# EAGLE design V3 (EAGLE 6.4)
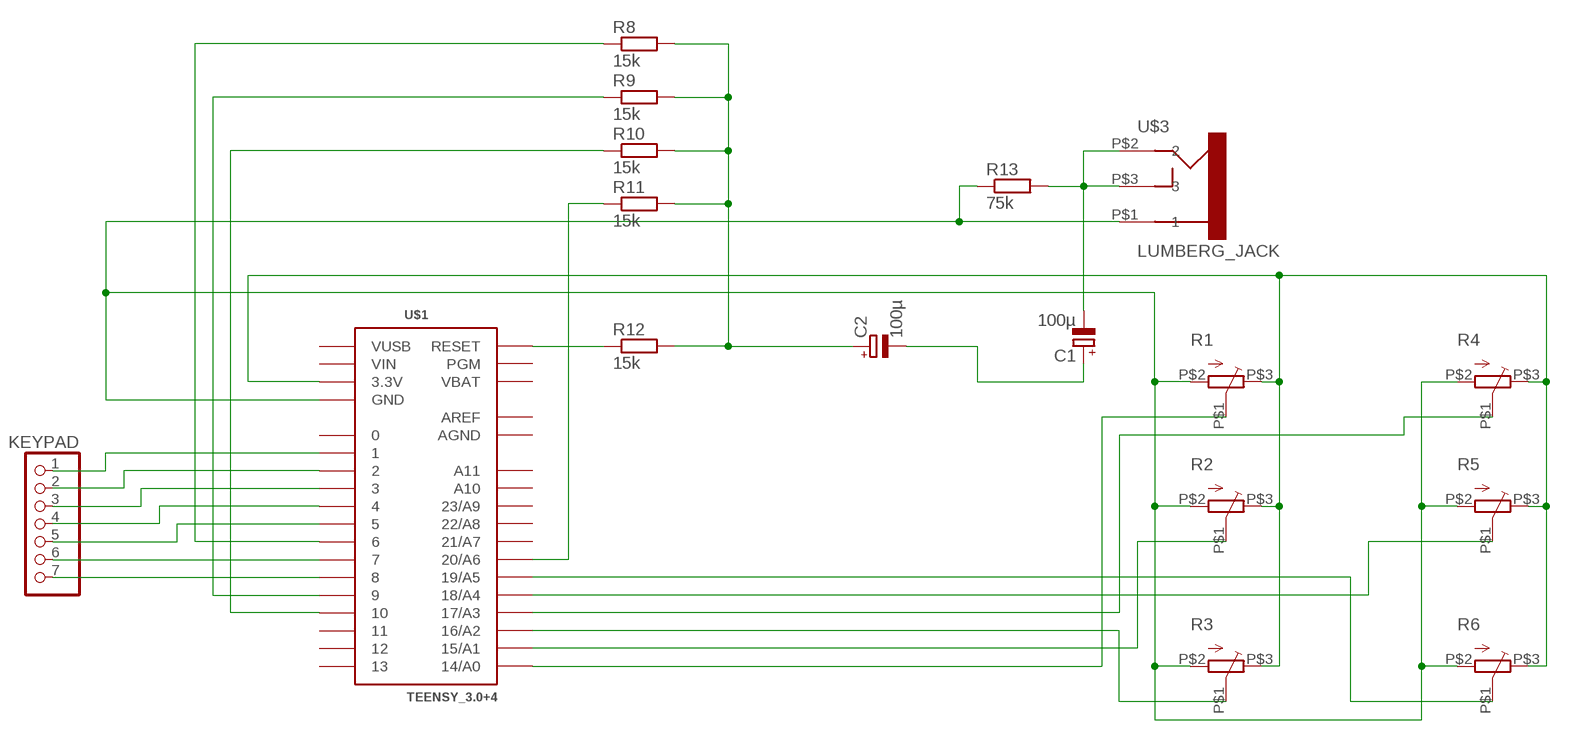
[diagram p0: schematic, sheet 1]

## Parts
C1  100µ  CPOL-EUE2.5-6  [E2,5-6]
C2  100µ  CPOL-EUE2.5-6  [E2,5-6]
KEYPAD  PINHD-1X7  [1X07]
R1  STR09K113  [STR09K113]
R2  STR09K113  [STR09K113]
R3  STR09K113  [STR09K113]
R4  STR09K113  [STR09K113]
R5  STR09K113  [STR09K113]
R6  STR09K113  [STR09K113]
R8  15k  R-EU_0309/12  [0309/12]
R9  15k  R-EU_0309/12  [0309/12]
R10  15k  R-EU_0309/12  [0309/12]
R11  15k  R-EU_0309/12  [0309/12]
R12  15k  R-EU_0309/12  [0309/12]
R13  75k  R-EU_0309/12  [0309/12]
U$1  TEENSY_3.0+4  [TEENSY_3.0+4]
U$3  LUMBERG_JACK  [JACK_CON]

## Nets
GND: R1.P$2(S) R2.P$2(S) R3.P$2(S) R4.P$2(S) R5.P$2(S) R6.P$2(S) R13.1 U$1.GND U$1.GND1(GND) U$3.P$1
N$1: R1.P$1(W) U$1.14/A0
N$2: R2.P$1(W) U$1.15/A1
N$3: R3.P$1(W) U$1.16/A2
N$4: R4.P$1(W) U$1.17/A3
N$5: R5.P$1(W) U$1.18/A4
N$6: R6.P$1(W) U$1.19/A5
N$7: KEYPAD.5 U$1.5
N$8: R1.P$3(E) R2.P$3(E) R3.P$3(E) R4.P$3(E) R5.P$3(E) R6.P$3(E) U$1.3.3V U$1.3.3V1(3.3V)
N$9: C1.- R13.2 U$3.P$2 U$3.P$3
N$10: KEYPAD.4 U$1.4
N$11: KEYPAD.3 U$1.3
N$12: KEYPAD.2 U$1.2
N$13: R8.1 U$1.6
N$14: KEYPAD.6 U$1.7
N$15: KEYPAD.7 U$1.8
N$16: KEYPAD.1 U$1.1
N$22: R9.1 U$1.9
N$23: R10.1 U$1.10
N$26: R12.1 U$1.RESET
N$27: C1.+ C2.-
N$29: R11.1 U$1.20/A6
N$31: C2.+ R8.2 R9.2 R10.2 R11.2 R12.2
Unconnected: U$1.0 U$1.11 U$1.12 U$1.13 U$1.21/A7 U$1.22/A8 U$1.23/A9 U$1.A10 U$1.A11 U$1.PGM

## Power pins joined to a net without a drawn wire
AGND: U$1.AGND
AREF: U$1.AREF
VBAT: U$1.VBAT
VIN: U$1.VIN
VUSB: U$1.VUSB

## Library data of the parts
C1 C2 = rcl:CPOL-EU: POLARIZED CAPACITOR, European symbol
KEYPAD = pinhead:PINHD-1X7: PIN HEADER
R1-R6 = anyma-lib:STR09K113: Alps Potentiometer
R8-R13 = resistor:R-EU_: RESISTOR, European symbol
U$1 = Teensy3.0:TEENSY_3.0+4: Teensy 3.0 board, showing all pins that are easily acessible. See 'AllAnalogPins" and 'AllPins' packages for additional pin holes, as needed. The 'Basic' package has fewer pins.
U$3 = eigene:LUMBERG_JACK: 3.5 mm Jack connector 1502 03

## Board
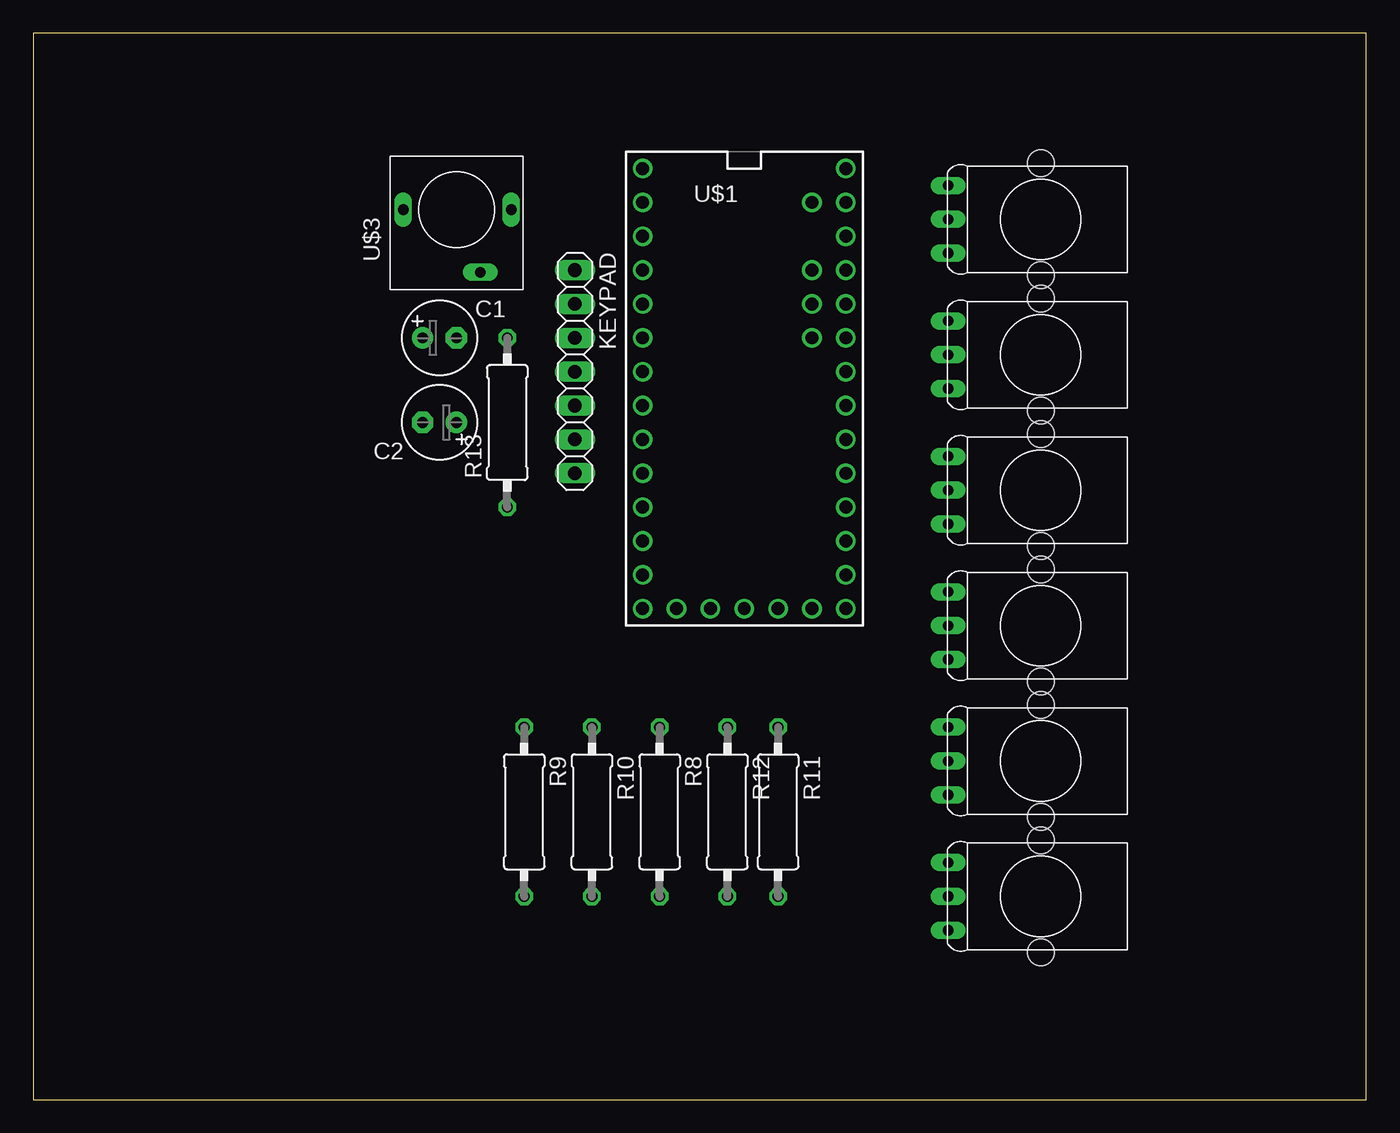
[diagram p1: board, top side]
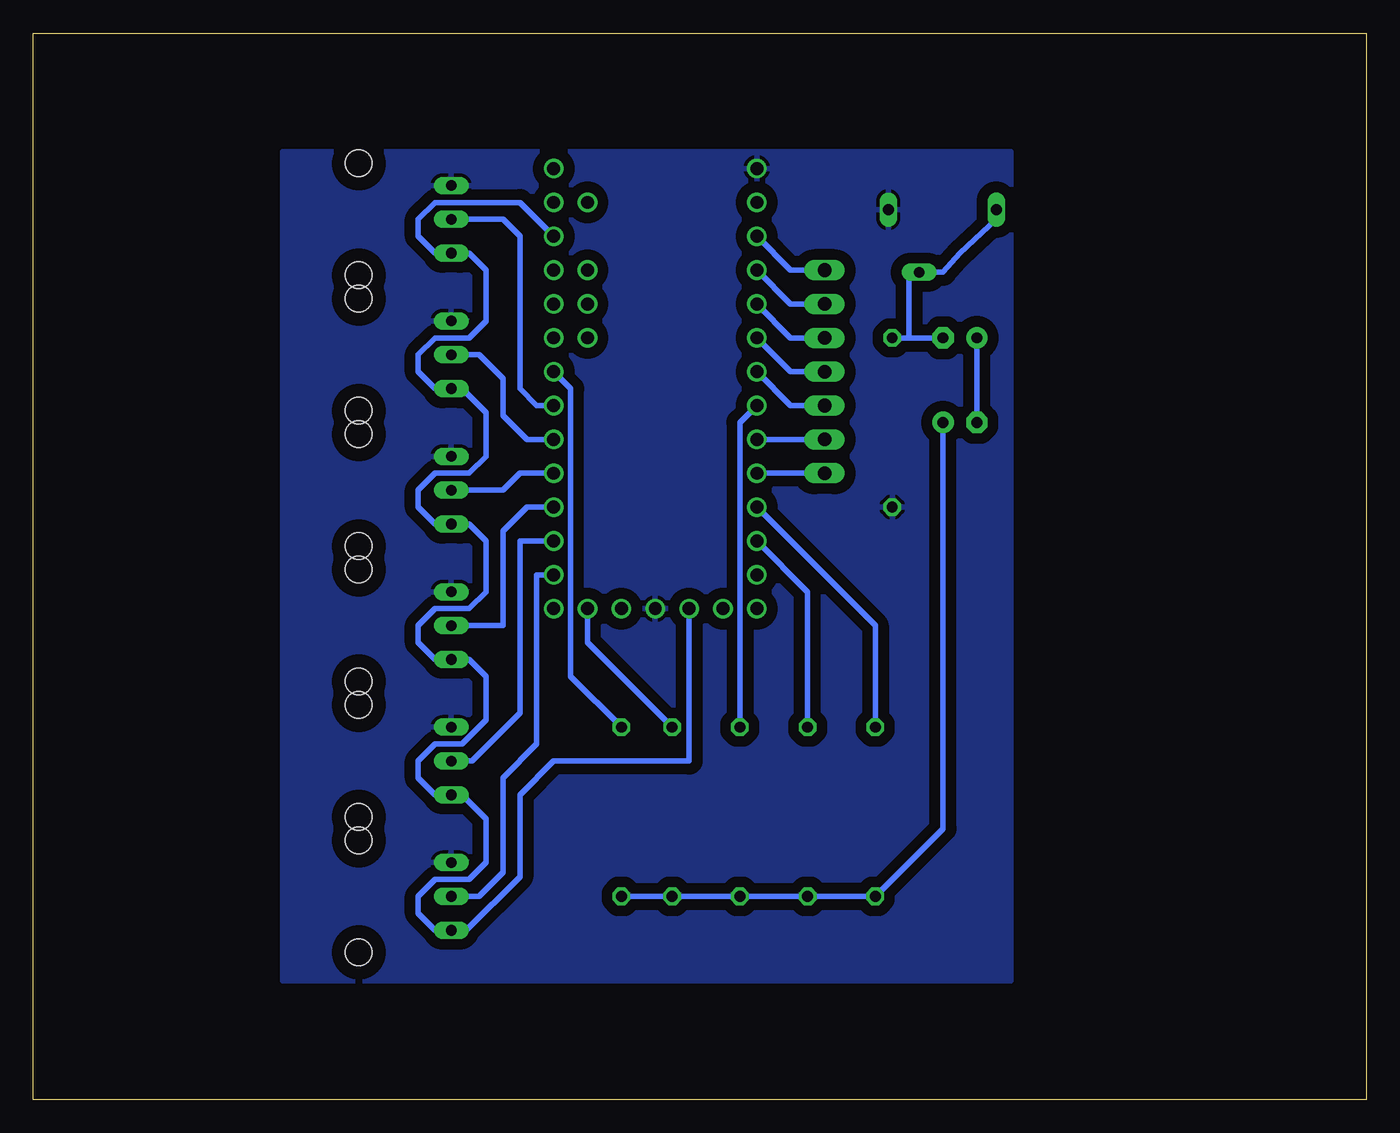
[diagram p2: board, bottom side, seen from below]

Size 100 x 80 mm. Coordinates in mm from the lower left corner, seen from the top.
Outline: 0,0 100,0 100,80 0,80 0,0
Copper layers (1*16): Top 0.035mm / dielectric 1.5mm / Bottom 0.035mm
Design rules "default *": minimum track width 10mil, minimum drill 24mil, track to track 32mil, track to pad 32mil, pad to pad 32mil, via to via 32mil, smd to smd 32mil, copper to edge 40mil, drill to drill 8mil, minimum pad ring 10mil, minimum via ring 8mil, stop-mask expansion 4mil, vias tented up to drill 0mil, thermal gap 10mil

### Footprints (pad centres in the part's own frame; a part is rotated, then mirrored left to right if it is on the bottom)
E2,5-6 = drill 0.813 pad 1.6: + -1.27,0 | drill 0.813 pad 1.6 octagon: - 1.27,0
1X07 = drill 1.016 long: 1 -7.62,0; 2 -5.08,0; 3 -2.54,0; 4 0,0; 5 2.54,0; 6 5.08,0; 7 7.62,0
STR09K113 = drill 0.8 long: P$1 0,0.06; P$2 -2.54,0.06; P$3 2.54,0.06 | hole 2: -4.2,7; 4.2,7
0309/12 = drill 0.813 octagon: 1 -6.35,0; 2 6.35,0
TEENSY_3.0+4 = drill 0.965: 0 -7.62,13.97; 1 -7.62,11.43; 2 -7.62,8.89; 3 -7.62,6.35; 3.3V 7.62,11.43; 3.3V1 -2.54,-16.51; 4 -7.62,3.81; 5 -7.62,1.27; 6 -7.62,-1.27; 7 -7.62,-3.81; 8 -7.62,-6.35; 9 -7.62,-8.89; 10 -7.62,-11.43; 11 -7.62,-13.97; 12 -7.62,-16.51; 13 7.62,-16.51; 14/A0 7.62,-13.97; 15/A1 7.62,-11.43; 16/A2 7.62,-8.89; 17/A3 7.62,-6.35; 18/A4 7.62,-3.81; 19/A5 7.62,-1.27; 20/A6 7.62,1.27; 21/A7 7.62,3.81; 22/A8 7.62,6.35; 23/A9 7.62,8.89; A10 5.08,6.35; A11 5.08,3.81; AGND 7.62,13.97; AREF 5.08,8.89; GND -7.62,16.51; GND1 0,-16.51; PGM 2.54,-16.51; RESET 5.08,-16.51; VBAT -5.08,-16.51; VIN 7.62,16.51; VUSB 5.08,13.97
JACK_CON = drill 0.8 long: P$1 2,-4.1; P$2 2,4; P$3 -2.7,-1.8

### Placement (x,y rotation side)
C1  30.48,57.15 0 top
C2  30.48,50.8 180 top
KEYPAD  40.64,54.61 270 top
R1  68.58,15.24 270 top
R2  68.58,25.4 270 top
R3  68.58,35.56 270 top
R4  68.58,45.72 270 top
R5  68.58,55.88 270 top
R6  68.58,66.04 270 top
R8  46.99,21.59 270 top
R9  36.83,21.59 270 top
R10  41.91,21.59 270 top
R11  55.88,21.59 270 top
R12  52.07,21.59 270 top
R13  35.56,50.8 90 top
U$1  53.34,53.34 0 top
U$3  31.75,64.77 90 top

### Tracks (layer width: path | path; a pad name or v marks a point on that pad's centre or on a via)
GND
  pour Bottom: 26.67,71.12 81.28,71.12 81.28,8.89 26.67,8.89
N$1
  Bottom 0.406: U$1.14/A0 62.23,39.37 62.23,26.67 64.77,24.13 64.77,17.04 66.57,15.24 R1.P$1
N$2
  Bottom 0.406: U$1.15/A1 63.5,41.91 63.5,28.99 67.09,25.4 R2.P$1
N$3
  Bottom 0.406: R3.P$1 64.77,35.56 64.77,42.65 62.97,44.45 U$1.16/A2
N$4
  Bottom 0.406: R4.P$1 64.77,45.72 63.5,46.99 U$1.17/A3
N$5
  Bottom 0.406: R5.P$1 66.57,55.88 64.77,54.08 64.77,51.33 62.97,49.53 U$1.18/A4
N$6
  Bottom 0.406: R6.P$1 64.77,66.04 63.5,64.77 63.5,53.34 62.23,52.07 U$1.19/A5
N$7
  Bottom 0.406: U$1.5 43.18,52.07 KEYPAD.5
N$8
  Bottom 0.406: U$1.3.3V1 50.8,25.4 60.96,25.4 63.5,22.86 63.5,16.72 67.52,12.7 R1.P$3 69.85,12.7 71.12,13.97 71.12,15.24 69.85,16.51 67.31,16.51 66.04,17.78 66.04,21.06 67.84,22.86 R2.P$3 69.85,22.86 71.12,24.13 71.12,25.4 69.85,26.67 67.84,26.67 66.04,28.47 66.04,31.75 67.31,33.02 R3.P$3 69.85,33.02 71.12,34.29 71.12,35.56 69.85,36.83 67.31,36.83 66.04,38.1 66.04,41.91 67.31,43.18 R4.P$3 69.85,43.18 71.12,44.45 71.12,45.72 69.85,46.99 67.31,46.99 66.04,48.26 66.04,51.54 67.84,53.34 R5.P$3 69.85,53.34 71.12,54.61 71.12,55.88 69.85,57.15 67.31,57.15 66.04,58.42 66.04,62.23 67.31,63.5 R6.P$3 69.85,63.5 71.12,64.77 71.12,66.04 69.85,67.31 63.5,67.31 U$1.3.3V
N$9
  Bottom 0.406: R13.2 34.29,57.15 | 34.29,57.15 C1.- | 34.29,57.15 34.29,62.07 U$3.P$3 31.75,62.07 30.48,63.5 27.75,66.04 U$3.P$2
N$10
  Bottom 0.406: U$1.4 43.18,54.61 KEYPAD.4
N$11
  Bottom 0.406: U$1.3 43.18,57.15 KEYPAD.3
N$12
  Bottom 0.406: U$1.2 43.18,59.69 KEYPAD.2
N$13
  Bottom 0.406: R8.1 46.99,50.8 U$1.6
N$14
  Bottom 0.406: KEYPAD.6 U$1.7
N$15
  Bottom 0.406: KEYPAD.7 U$1.8
N$16
  Bottom 0.406: U$1.1 43.18,62.23 KEYPAD.1
N$22
  Bottom 0.406: U$1.9 36.83,35.56 R9.1
N$23
  Bottom 0.406: R10.1 41.91,38.1 U$1.10
N$26
  Bottom 0.406: R12.1 58.42,34.29 U$1.RESET
N$27
  Bottom 0.406: C2.- C1.+
N$29
  Bottom 0.406: R11.1 59.69,31.75 59.69,53.34 U$1.20/A6
N$31
  Bottom 0.406: R8.2 R9.2 | R9.2 R10.2 R8.2 | R8.2 R12.2 R11.2 | R9.2 31.75,20.32 C2.+